# EAGLE design MySensors_Interfacing24V (EAGLE 8.3.2)
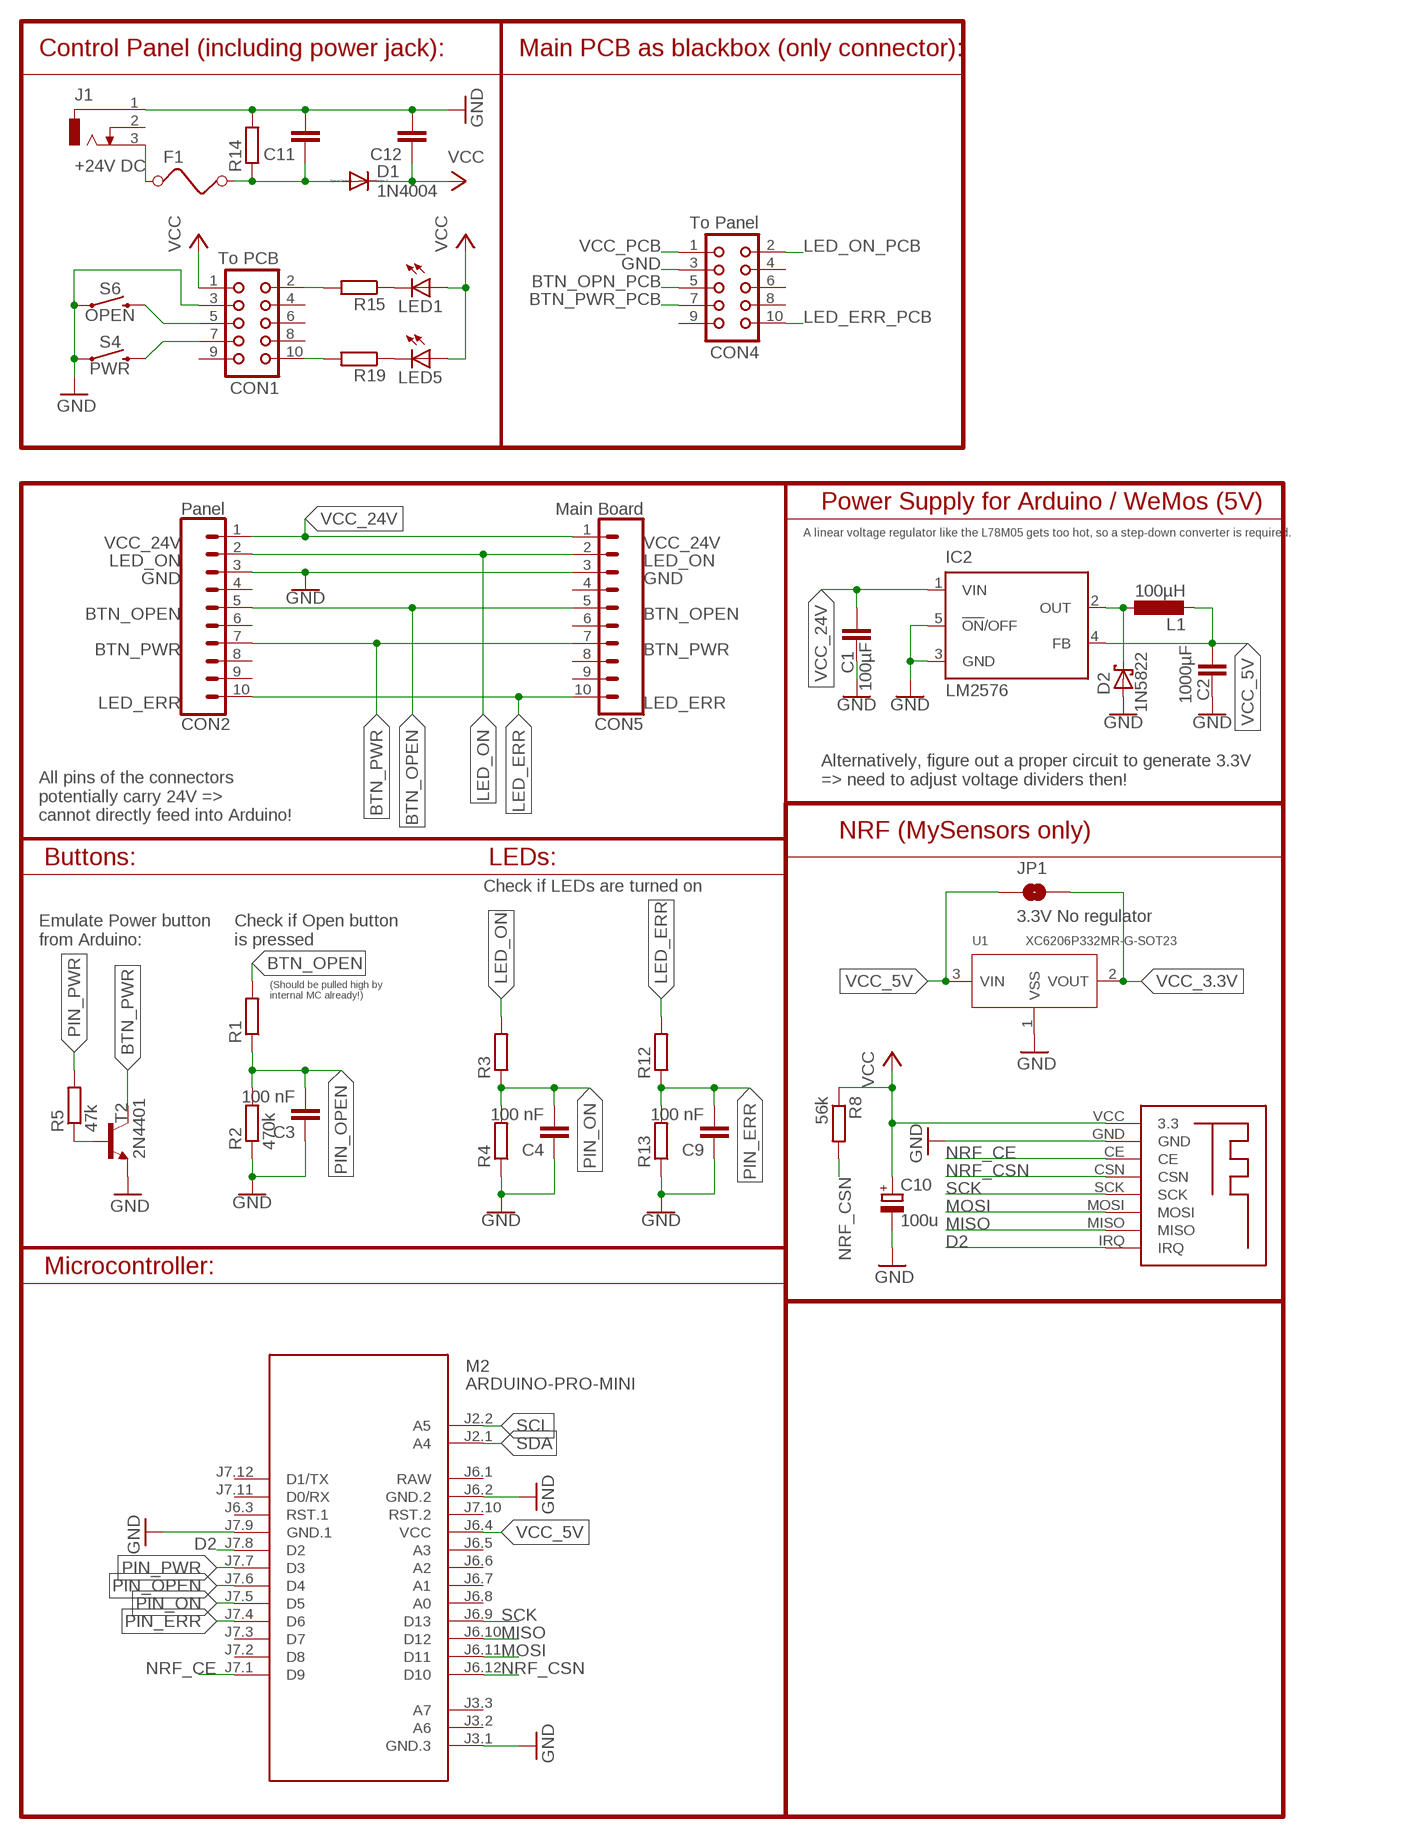
[diagram p0: schematic, sheet 1]

## Parts
C1  100µF  C-EUC0805  [C0805]
C2  1000µF  C-EUC0805  [C0805]
C3  100 nF  C-EUC0805  [C0805]
C4  100 nF  C-EUC0805  [C0805]
C9  100 nF  C-EUC0805  [C0805]
C10  100u  CPOL-EUUD-5X5,8  [UD-5X5,8_NICHICON]
C11  C-EUC0805K  [C0805K]
C12  C-EUC0805K  [C0805K]
CON1  To PCB  CON10  [CON10]
CON2  Panel  CONN_10LOCK_LONGPADS  [1X10_LOCK_LONGPADS]
CON4  To Panel  CON10  [CON10]
CON5  Main Board  CONN_10LOCK_LONGPADS  [1X10_LOCK_LONGPADS]
D1  1N4004  [DO41-10]
D2  1N5822  SCHOTTKY-DIODESMD  [SMB]
F1  FUSE  [FUSE]
IC2  LM2576  LM2596S  [TO263-5]
J1  +24V DC  DCJ0202  [DCJ0202]
JP1  3.3V No regulator  JUMPER-SMT_2_NO_SILK  [SMT-JUMPER_2_NO_SILK]
L1  100µH  L-EUWE-TPC  [POWER-CHOKE_WE-TPC]
LED1  LEDCHIPLED_0805  [CHIPLED_0805]
LED5  LEDCHIPLED_0805  [CHIPLED_0805]
M2  ARDUINO-PRO-MINI  ARDUINO-PRO-MINI-3.3V#NP  [ARDUINO-PRO-MINI#NP]
R1  R-EU_R0805  [R0805]
R2  470k  R-EU_R0805  [R0805]
R3  R-EU_R0805  [R0805]
R4  R-EU_R0805  [R0805]
R5  47k  R-EU_R0805  [R0805]
R8  56k  R-EU_R0805  [R0805]
R12  R-EU_R0805  [R0805]
R13  R-EU_R0805  [R0805]
R14  R-EU_R0805  [R0805]
R15  R-EU_R0805  [R0805]
R19  R-EU_R0805  [R0805]
S4  PWR  MOMENTARY-SWITCH-SPST-PTH-6.0MM  [TACTILE_SWITCH_PTH_6.0MM]
S6  OPEN  MOMENTARY-SWITCH-SPST-PTH-6.0MM  [TACTILE_SWITCH_PTH_6.0MM]
T2  2N4401  MMBT4401LT1-NPN-SOT23-BEC  [SOT23-BEC]
U1  XC6206P332MR-G-SOT23  PMIC-LDO-XC6206P332MR-G(SOT23)  [SOT-23]
U$2  NRF24SMD  [NRF24SMD]

## Nets
BTN_OPEN: CON2.5 CON5.5 R1.2
BTN_OPEN_PANEL: CON1.5 S6.3
BTN_OPN_PCB: CON4.5
BTN_PWR: CON2.7 CON5.7 T2.C
BTN_PWR_PANEL: CON1.7 S4.3
BTN_PWR_PCB: CON4.7
D2: M2.J7.8(D2) U$2.IRQ
GND: C1.2 C2.2 C3.1 C4.1 C9.1 C11.2 C12.2 CON1.3 CON2.3 CON4.3 CON5.3 D2.A IC2.3(GND) IC2.5(!ON!/OFF) J1.1 M2.J3.1(GND.3) M2.J6.2(GND.2) M2.J7.9(GND.1) R2.1 R4.1 R13.1 R14.2 S4.1 S6.1 T2.E
GND_ARD: C10.- U$2.GND ; supply symbol labelled GND
LED_ERR: CON2.10 CON5.10 R12.2
LED_ERR_PANEL: CON1.10 R19.2
LED_ERR_PCB: CON4.10
LED_ON: CON2.2 CON5.2 R3.2
LED_ON_PANEL: CON1.2 R15.2
LED_ON_PCB: CON4.2
MISO: M2.J6.10(D12) U$2.MISO
MOSI: M2.J6.11(D11) U$2.MOSI
N$1: F1.1 J1.3
N$2: R5.1 T2.B
N$3: C11.1 D1.A F1.2 R14.1
N$4: D2.C IC2.2(OUT) L1.1
N$8: LED1.C R15.1
N$12: LED5.C R19.1
NRF_CE: M2.J7.1(D9) U$2.CE
NRF_CSN: M2.J6.12(D10) R8.2 U$2.CSN
PIN_ERR: C9.2 M2.J7.4(D6) R12.1 R13.2
PIN_ON: C4.2 M2.J7.5(D5) R3.1 R4.2
PIN_OPEN: C3.2 M2.J7.6(D4) R1.1 R2.2
PIN_PWR: M2.J7.7(D3)
SCK: M2.J6.9(D13) U$2.SCK
SCL: M2.J2.2(A5)
SDA: M2.J2.1(A4)
VCC: C12.1 D1.C LED1.A LED5.A
VCC_3.3V: C10.+ JP1.2 R8.1 U1.2(VOUT) U$2.VCC(3.3) ; supply symbol labelled VCC
VCC_5V: C2.1 IC2.4(FB) JP1.1 L1.2 M2.J6.4(VCC) U1.3(VIN)
VCC_24V: C1.1 CON1.1 CON2.1 CON5.1 IC2.1(VIN) ; supply symbol labelled VCC
VCC_PCB: CON4.1
VSS: U1.1(VSS) ; supply symbol labelled GND
Unconnected: CON1.4 CON1.6 CON1.8 CON1.9 CON2.4 CON2.6 CON2.8 CON2.9 CON4.4 CON4.6 CON4.8 CON4.9 CON5.4 CON5.6 CON5.8 CON5.9 J1.2 M2.J3.2(A6) M2.J3.3(A7) M2.J6.3(RST.1) M2.J6.5(A3) M2.J6.6(A2) M2.J6.7(A1) M2.J6.8(A0) M2.J7.2(D8) M2.J7.3(D7) M2.J7.10(RST.2) M2.J7.11(D0/RX) M2.J7.12(D1/TX) R5.2

## Notes on the sheet
- Control Panel (including power jack): | Main PCB as blackbox (only connector):
- Power Supply for Arduino / WeMos (5V)
- A linear voltage regulator like the L78M05 gets too hot, so a step-down converter is required.
- Alternatively, figure out a proper circuit to generate 3.3V 
  => need to adjust voltage dividers then!
- All pins of the connectors 
  potentially carry 24V => 
  cannot directly feed into Arduino!
- NRF (MySensors only)
- Buttons: | LEDs:
- Check if LEDs are turned on
- Emulate Power button 
  from Arduino:
- Check if Open button 
  is pressed
- (Should be pulled high by 
  internal MC already!)
- Microcontroller:

## Power pins joined to a net without a drawn wire
RAW: M2.J6.1(RAW)

## Library data of the parts
C1 C2 C11 C12 = rcl:C-EU: CAPACITOR, European symbol
C3 C4 C9 = resistor:C-EU: CAPACITOR, European symbol
C10 = rcl:CPOL-EU: POLARIZED CAPACITOR, European symbol
CON1 CON4 = con-harting:CON10: CONNECTOR; OC_FARNELL: unknown; OC_NEWARK: unknown
CON2 CON5 = SparkFun-Connectors:CONN_10: Multi connection point. Often used as Generic Header-pin footprint for 0.1 inch spaced/style header connections On any of the 0.1 inch spaced packages, you can populate with these: Break Away Headers - Straight <https://www.sparkfun.com/products/116> (PRT-00116) Break Away Male Headers - Right Angle <https://www.sparkfun.com/products/553> (PRT-00553) Female Headers <https://www.sparkfun.com/products/115> (PRT-00115) Break Away Headers - Machine Pin <https://www.sparkfun.com/products/117> (PRT-00117) Break Away Female Headers - Swiss Machine Pin <https://www.sparkfun.com/products/743> (PRT-00743) Arduino Stackable Header - 10 Pin <https://www.sparkfun.com/products/11376> (PRT-11376) For SCREWTERMINALS and SPRING TERMINALS visit here: Screw Terimnals on SparkFun.com <https://www.sparkfun.com/search/results?term=Screw+Terminals> (5mm/3.5mm/2.54mm spacing) This device is also useful as a general connection point to wire up your design to another part of your project. Our various solder wires solder well into these plated through hole pads. Hook-Up Wire - Assortment (Stranded, 22 AWG) <https://www.sparkfun.com/products/11375> (PRT-11375) Hook-Up Wire - Assortment (Solid Core, 22 AWG) <https://www.sparkfun.com/products/11367> (PRT-11367) View the entire wire category on our website here <https://www.sparkfun.com/categories/141> Special notes: Molex polarized connector foot print use with SKU : PRT-08231 with associated crimp pins and housings. 1MM SMD Version SKU: PRT-10208 NOTES ON THE VARIANTS LOCK and LOCK_LONGPADS... This footprint was designed to help hold the alignment of a through-hole component (i.e. 6-pin header) while soldering it into place. You may notice that each hole has been shifted either up or down by 0.005 of an inch from it's more standard position (which is a perfectly straight line). This slight alteration caused the pins (the squares in the middle) to touch the edges of the holes. Because they are alternating, it causes a "brace" to hold the component in place. 0.005 has proven to be the perfect amount of "off-center" position when using our standard breakaway headers. Although looks a little odd when you look at the bare footprint, once you have a header in there, the alteration is very hard to notice. Also,if you push a header all the way into place, it is covered up entirely on the bottom side.
D1 = diode:1N4004: DIODE general purpose rectifier, 1 A
D2 = diode:SCHOTTKY-DIODE: Schottky Diode
F1 = special:FUSE: FUSE 5 x 20 mm
IC2 = national-semiconductor:LM2596: SIMPLE SWITCHER® Power Converter 150 kHz 3A Step-Down Voltage Regulator Source: http://www.national.com/ds/LM/LM2596.pdf; MF: NATIONAL SEMICONDUCTOR; MPN: LM2596S-ADJ/NOPB; OC_FARNELL: 9494367; OC_NEWARK: 41K3842
J1 = con-jack:DCJ0202: DC POWER JACK Source: DCJ0202.pdf; OC_FARNELL: unknown; OC_NEWARK: unknown
JP1 = SparkFun-Jumpers:JUMPER-SMT_2_NO: Normally open jumper This jumper has two pads in close proximity to each other. Apply solder to close the connection. Round pads are easier to solder for beginners, but are a lot larger. SparkFun Product that uses the round pads: SparkFun EL Sequencer <https://www.sparkfun.com/products/12781>
L1 = rcl:L-EU: INDUCTOR, European symbol
LED1 LED5 = led:LED: LED OSRAM: - CHIPLED LG R971, LG N971, LY N971, LG Q971, LY Q971, LO R971, LY R971 LH N974, LH R974 LS Q976, LO Q976, LY Q976 LO Q996 - Hyper CHIPLED LW Q18S LB Q993, LB Q99A, LB R99A - SideLED LS A670, LO A670, LY A670, LG A670, LP A670 LB A673, LV A673, LT A673, LW A673 LH A674 LY A675 LS A676, LA A676, LO A676, LY A676, LW A676 LS A679, LY A679, LG A679 - Hyper Micro SIDELED® LS Y876, LA Y876, LO Y876, LY Y876 LT Y87S - SmartLED LW L88C, LW L88S LB L89C, LB L89S, LG L890 LS L89K, LO L89K, LY L89K LS L896, LA L896, LO L896, LY L896 - TOPLED LS T670, LO T670, LY T670, LG T670, LP T670 LSG T670, LSP T670, LSY T670, LOP T670, LYG T670 LG T671, LOG T671, LSG T671 LB T673, LV T673, LT T673, LW T673 LH T674 LS T676, LA T676, LO T676, LY T676, LB T676, LH T676, LSB T676, LW T676 LB T67C, LV T67C, LT T67C, LS T67K, LO T67K, LY T67K, LW E67C LS E67B, LA E67B, LO E67B, LY E67B, LB E67C, LV E67C, LT E67C LW T67C LS T679, LY T679, LG T679 LS T770, LO T770, LY T770, LG T770, LP T770 LB T773, LV T773, LT T773, LW T773 LH T774 LS E675, LA E675, LY E675, LS T675 LS T776, LA T776, LO T776, LY T776, LB T776 LHGB T686 LT T68C, LB T68C - Hyper Mini TOPLED® LB M676 - Mini TOPLED Santana® LG M470 LS M47K, LO M47K, LY M47K Source: http://www.osram.convergy.de LUXEON: - LUMILED® LXK2-PW12-R00, LXK2-PW12-S00, LXK2-PW14-U00, LXK2-PW14-V00 LXK2-PM12-R00, LXK2-PM12-S00, LXK2-PM14-U00 LXK2-PE12-Q00, LXK2-PE12-R00, LXK2-PE12-S00, LXK2-PE14-T00, LXK2-PE14-U00 LXK2-PB12-K00, LXK2-PB12-L00, LXK2-PB12-M00, LXK2-PB14-N00, LXK2-PB14-P00, LXK2-PB14-Q00 LXK2-PR12-L00, LXK2-PR12-M00, LXK2-PR14-Q00, LXK2-PR14-R00 LXK2-PD12-Q00, LXK2-PD12-R00, LXK2-PD12-S00 LXK2-PH12-R00, LXK2-PH12-S00 LXK2-PL12-P00, LXK2-PL12-Q00, LXK2-PL12-R00 Source: www.luxeon.com KINGBRIGHT: KA-3528ASYC Source: www.kingbright.com
M2 = diy-modules:ARDUINO-PRO-MINI-*#NP: Arduino Pro Mini (and compatible devices) without programming pads More details available here: https://www.arduino.cc/en/Main/ArduinoBoardProMini Click here to find device on ebay.com <http://www.ebay.com/sch/arduino+pro+mini>
R1-R5 R12-R15 R19 = resistor:R-EU_: RESISTOR, European symbol
R8 = rcl:R-EU_: RESISTOR, European symbol
S4 S6 = SparkFun-Switches:MOMENTARY-SWITCH-SPST: Momentary Switch (Pushbutton) - SPST Normally-open (NO) SPST momentary switches (buttons, pushbuttons). Variants PTH-12MM - 12mm square, through-hole Momentary Pushbutton Switch - 12mm Square <https://www.sparkfun.com/products/9190> (COM-09190) PTH-6.0MM, PTH-6.0MM-KIT - 6.0mm square, through-hole Mini Pushbutton Switch <https://www.sparkfun.com/products/97> (COM-00097) KIT package intended for soldering kit's - only one side of pads' copper is exposed. PTH-RIGHT-ANGLE-KIT - Right-angle, through-hole Right Angle Tactile Button <https://www.sparkfun.com/products/10791> - Used on SparkFun BigTime Watch Kit <https://www.sparkfun.com/products/11734> SMD-12MM - 12mm square, surface-mount Tactile Button - SMD (12mm) <https://www.sparkfun.com/products/12993> (COM-12993) Used on SparkFun PicoBoard <https://www.sparkfun.com/products/11888> SMD-4.5MM - 4.5mm Square Trackball Switch Used on SparkFun Blackberry Trackballer Breakout <https://www.sparkfun.com/products/13169> SMD-4.6MMX2.8MM - 4.60mm x 2.80mm, surface mount Used on SparkFun SAMD21 Mini Breakout <https://www.sparkfun.com/products/13664> SMD-5.2MM, SMD-5.2-REDUNDANT - 5.2mm square, surface-mount Mini Pushbutton Switch - SMD <https://www.sparkfun.com/products/8720> (COM-08720) Used on Arduino Pro Mini <https://www.sparkfun.com/products/11114> REDUNDANT package connects both switch circuits together SMD-6.0X3.5MM - 6.0 x 3.5mm, surface mount Momentary Reset Switch SMD <https://www.sparkfun.com/products/8229> (COM-08229) SMD-6.2MM-TALL - 6.2mm square, surface mount Tactile Button - SMD (6mm) <https://www.sparkfun.com/products/12992> Used on SparkFun Digital Sandbox <https://www.sparkfun.com/products/12651> SMD-RIGHT-ANGLE - Right-angle, surface mount Used on SparkFun Block for Intel® Edison - Arduino <https://www.sparkfun.com/products/13036>; PROD_ID: SWCH-08441; SF_SKU: COM-00097
T2 = transistor:*-NPN-: NPN Transistror BF959 corrected 2008.03.06
U1 = Seeed-IC:PMIC-LDO-XC6206P332MR-G(SOT23): 310030099; MPN: XC6206P332MR-G
U$2 = NRF24_SMD:NRF24SMD

## Board
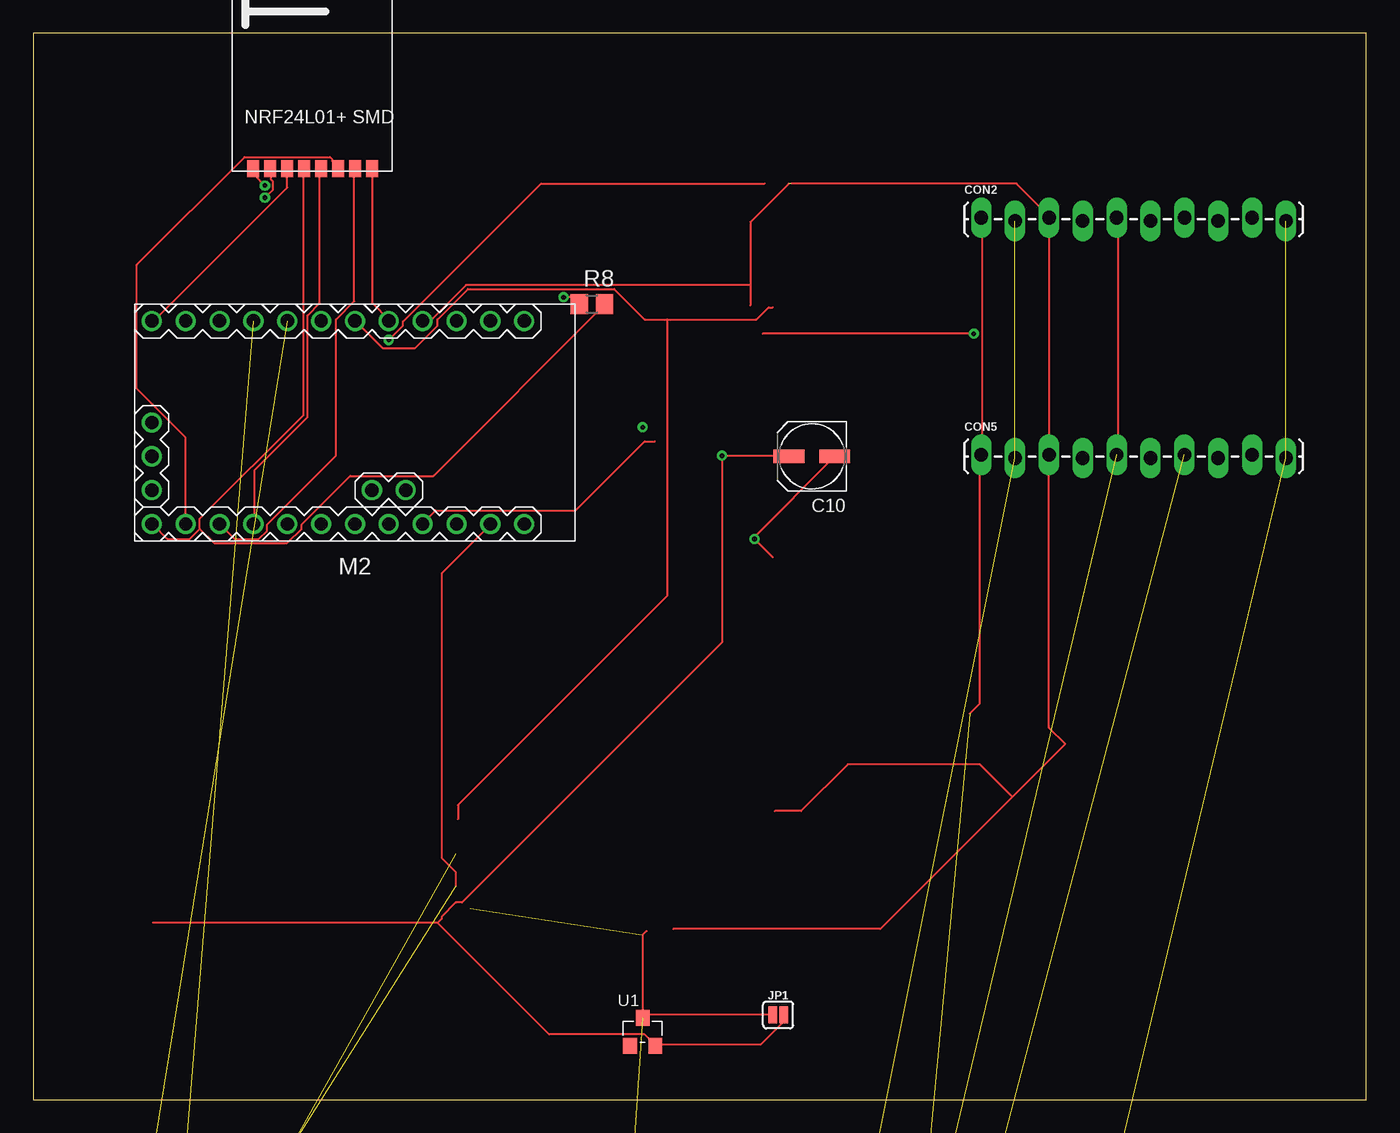
[diagram p1: board, top side]
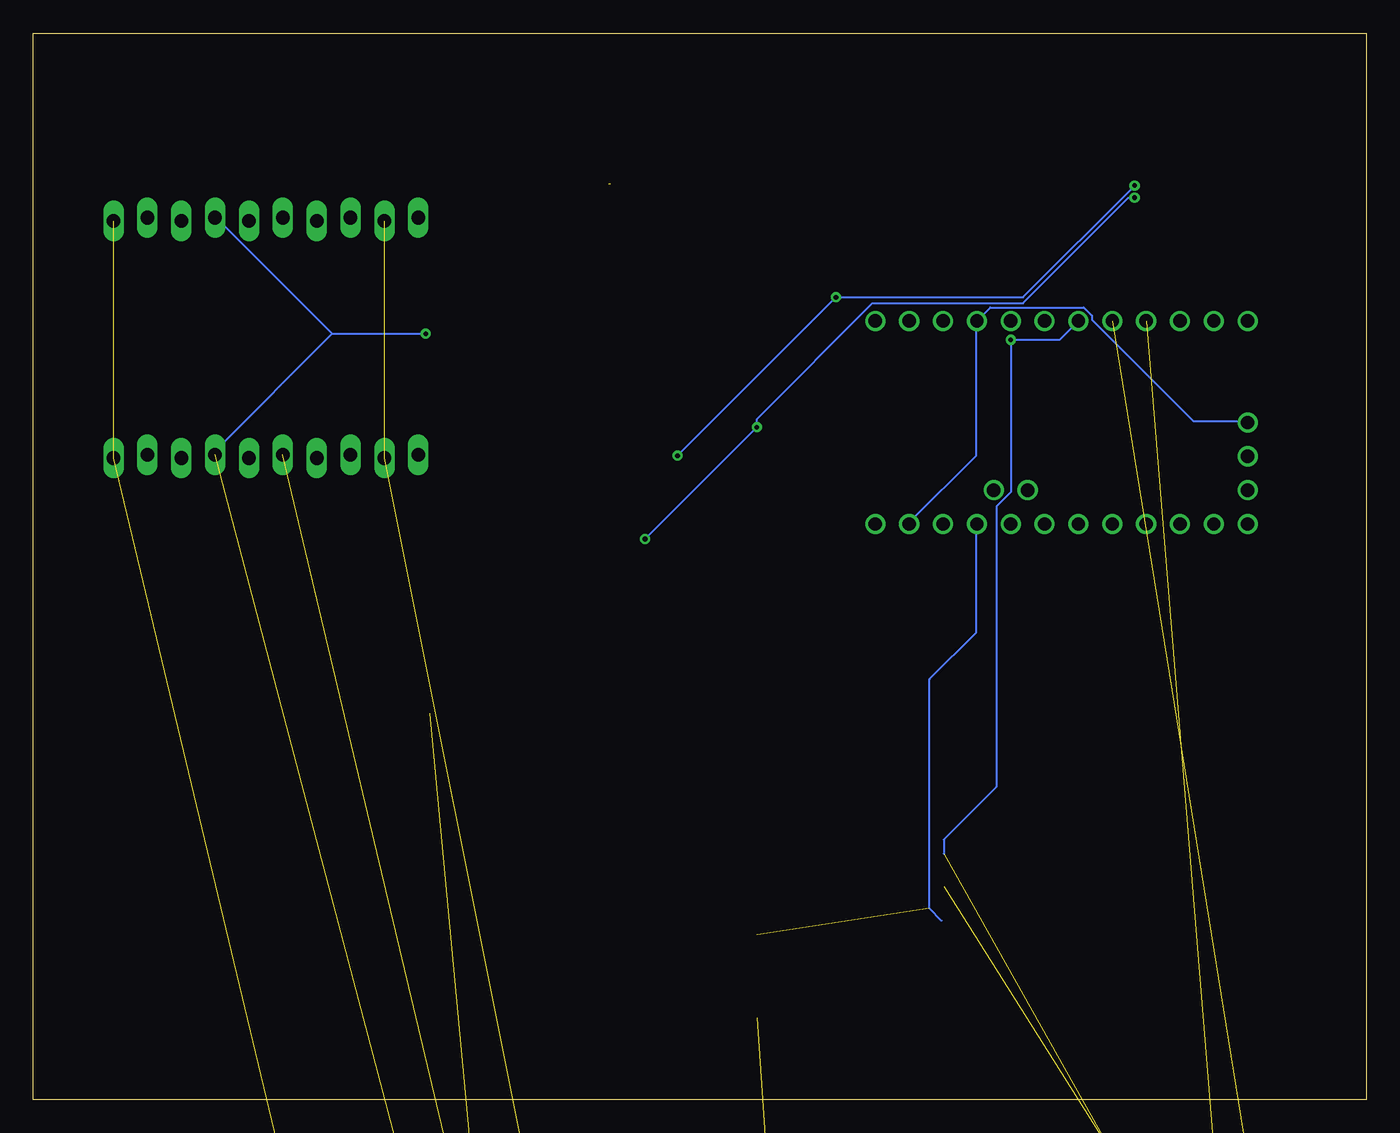
[diagram p2: board, bottom side, seen from below]

Size 100 x 80 mm. Coordinates in mm from the lower left corner, seen from the top.
Outline: 0,0 100,0 100,80 0,80 0,0
Copper layers (1*16): Top 0.035mm / dielectric 1.5mm / Bottom 0.035mm
Design rules "default": minimum track width 6mil, minimum drill 0.35mm, track to track 6mil, track to pad 6mil, pad to pad 6mil, via to via 6mil, smd to smd 6mil, copper to edge 40mil, drill to drill 6mil, minimum pad ring 10mil, minimum via ring 8mil, stop-mask expansion 4mil, vias tented up to drill 0mil, thermal gap 10mil

### Footprints (pad centres in the part's own frame; a part is rotated, then mirrored left to right if it is on the bottom)
C0805 = smd 1.3 x 1.5: 1 -0.95,0; 2 0.95,0
UD-5X5,8_NICHICON = smd 2.3 x 1: + 1.725,0; - -1.7,0
C0805K = smd 1.3 x 1.6: 1 -1,0; 2 1,0
CON10 = drill 0.914: 1 -5.08,-1.27 | drill 0.914 octagon: 2 -5.08,1.27; 3 -2.54,-1.27; 4 -2.54,1.27; 5 0,-1.27; 6 0,1.27; 7 2.54,-1.27; 8 2.54,1.27; 9 5.08,-1.27; 10 5.08,1.27
1X10_LOCK_LONGPADS = drill 1.016 long: 1 0,0.127; 2 2.54,-0.127; 3 5.08,0.127; 4 7.62,-0.127; 5 10.16,0.127; 6 12.7,-0.127; 7 15.24,0.127; 8 17.78,-0.127; 9 20.32,0.127; 10 22.86,-0.127
DO41-10 = drill 1.118: A 5.08,0; C -5.08,0
SMB = smd 2.4 x 2.4: A 2.2,0; C -2.2,0
FUSE = drill 1.321 long: 1 -11.43,0; 2 11.43,0
TO263-5 = smd 1.067 x 2.159: 1 -3.404,-5.791; 2 -1.702,-5.791; 3 0,-5.791; 4 1.702,-5.791; 5 3.404,-5.791 | smd 10.8 x 10.41: 6 0,2.54
DCJ0202 = drill 1 pad 2 long: 1 0,3.1; 2 4.8,0; 3 0,-3
SMT-JUMPER_2_NO_SILK = smd 0.635 x 1.27: 1 -0.406,0; 2 0.406,0
POWER-CHOKE_WE-TPC = smd 6.3 x 2.2: 1 0,2.05; 2 0,-2.05
CHIPLED_0805 = smd 1.2 x 1.2: A 0,-1.05; C 0,1.05
ARDUINO-PRO-MINI#NP = drill 1: J2.1 -1.27,5.08; J2.2 -3.81,5.08; J3.1 15.24,0; J3.2 15.24,2.54; J3.3 15.24,5.08; J6.1 -12.7,7.62; J6.2 -10.16,7.62; J6.3 -7.62,7.62; J6.4 -5.08,7.62; J6.5 -2.54,7.62; J6.6 0,7.62; J6.7 2.54,7.62; J6.8 5.08,7.62; J6.9 7.62,7.62; J6.10 10.16,7.62; J6.11 12.7,7.62; J6.12 15.24,7.62; J7.1 15.24,-7.62; J7.2 12.7,-7.62; J7.3 10.16,-7.62; J7.4 7.62,-7.62; J7.5 5.08,-7.62; J7.6 2.54,-7.62; J7.7 0,-7.62; J7.8 -2.54,-7.62; J7.9 -5.08,-7.62; J7.10 -7.62,-7.62; J7.11 -10.16,-7.62; J7.12 -12.7,-7.62
R0805 = smd 1.3 x 1.5: 1 -0.95,0; 2 0.95,0
TACTILE_SWITCH_PTH_6.0MM = drill 1.016 pad 1.88: 1 -3.251,2.261; 2 3.251,2.261; 3 -3.251,-2.261; 4 3.251,-2.261
SOT23-BEC = smd 1 x 1.4: B -0.95,-1.1; C 0,1.1; E 0.95,-1.1
SOT-23 = smd 1.016 x 1.2: 1 -0.95,-1.06; 2 0.95,-1.06; 3 0,1.06
NRF24SMD = smd 0.9 x 1.27: CE -1.27,-6.35; CSN 0,-6.35; GND -2.54,-6.35; IRQ 5.08,-6.35; MISO 3.81,-6.35; MOSI 2.54,-6.35; SCK 1.27,-6.35; VCC -3.81,-6.35

### Placement (x,y rotation side)
C1  20.32,-440.69 0 top  (outside the outline)
C2  12.7,-440.69 0 top  (outside the outline)
C3  2.54,-31.75 0 top  (outside the outline)
C4  2.54,-38.1 0 top  (outside the outline)
C9  2.54,-101.6 0 top  (outside the outline)
C10  58.42,48.26 180 top
C11  -1,-415.29 0 top  (outside the outline)
C12  -1,-427.99 0 top  (outside the outline)
CON1  55.88,-177.8 0 top  (outside the outline)
CON2  71.12,66.04 0 top
CON4  12.7,-198.12 0 top  (outside the outline)
CON5  71.12,48.26 0 top
D1  39.37,-196.85 0 top  (outside the outline)
D2  3.81,-440.69 0 top  (outside the outline)
F1  21.59,-177.8 0 top  (outside the outline)
IC2  15.24,-414.02 0 top  (outside the outline)
J1  10.16,-130.81 0 top  (outside the outline)
JP1  55.88,6.35 0 top
L1  7.62,-430.53 0 top  (outside the outline)
LED1  21.59,-210.82 0 top  (outside the outline)
LED5  46.99,-210.82 0 top  (outside the outline)
M2  24.13,50.8 180 top
R1  -0.95,-294.47 0 top  (outside the outline)
R2  -0.95,-307.17 0 top  (outside the outline)
R3  -0.95,-319.87 0 top  (outside the outline)
R4  -0.95,-332.57 0 top  (outside the outline)
R5  0,-402.59 0 top  (outside the outline)
R8  41.91,59.69 0 top
R12  -0.95,-345.27 0 top  (outside the outline)
R13  -0.95,-357.97 0 top  (outside the outline)
R14  -0.95,-370.67 0 top  (outside the outline)
R15  -0.95,-383.37 0 top  (outside the outline)
R19  -0.95,-396.07 0 top  (outside the outline)
S4  38.1,-129.54 0 top  (outside the outline)
S6  38.1,-156.21 0 top  (outside the outline)
T2  0,-280.67 0 top  (outside the outline)
U1  45.72,5.08 0 top
U$2  20.32,76.2 0 top

### Tracks (layer width: path | path; a pad name or v marks a point on that pad's centre or on a via)
BTN_OPEN  (1 unrouted)
  Top 0.152: CON5.5 81.38,48.46 81.38,66.14 CON2.5
BTN_OPEN_PANEL  (1 unrouted)
BTN_PWR  (via drill 0.35)  (1 unrouted)
  Top 0.152: v70.56,57.45 54.71,57.45
  Bottom 0.152: 77.57,57.45 v70.56,57.45 | 77.57,57.45 86.26,66.14 CON2.7 | 77.57,57.45 86.26,48.77 86.26,48.46 CON5.7
BTN_PWR_PANEL  (1 unrouted)
D2
  Top 0.152: U$2.IRQ 25.45,69.8 25.45,59.74 26.67,58.52 M2.J7.8
GND  (21 unrouted)
  Top 0.152: 31.7,16 31.7,17.07 30.63,18.14 30.63,39.47 34.29,43.13 M2.J6.2 | 53.8,61.11 53.8,65.84 56.69,68.73 | 53.8,61.11 53.8,59.59 | 56.84,68.73 73.76,68.73 76.2,66.29 CON2.3 CON5.3 76.2,27.89 77.42,26.67 73.46,22.71 | 48.01,12.8 63.55,12.8 73.46,22.71 | 55.63,21.64 57.61,21.64 61.11,25.15 71.02,25.15 73.46,22.71 | 53.8,61.11 32.46,61.11 29.87,58.52 29.26,58.52 M2.J7.9
  Bottom 0.152: M2.J3.1 8.99,50.9 12.95,50.9 20.57,58.52 20.57,58.83 21.18,59.44 28.19,59.44 M2.J7.9 29.26,58.37 29.26,48.31 34.29,43.28 M2.J6.2
GND_ARD  (via drill 0.35)
  Top 0.152: 55.47,40.69 v54.1,42.06 54.1,42.22 60.05,48.16 C10.- | v17.37,67.67 17.98,68.28 17.98,68.89 17.83,69.04 17.83,69.8 U$2.GND
  Bottom 0.152: v54.1,42.06 v45.72,50.44 45.72,51.05 37.03,59.74 25.76,59.74 17.83,67.67 v17.37,67.67
LED_ERR  (2 unrouted)
LED_ERR_PANEL  (1 unrouted)
LED_ON  (2 unrouted)
LED_ON_PANEL  (1 unrouted)
MISO
  Top 0.152: M2.J6.10 15.09,42.06 16.92,42.06 17.53,42.67 17.53,43.13 22.71,48.31 22.71,58.52 24.08,59.89 24.08,69.8 U$2.MISO
MOSI
  Top 0.152: M2.J6.11 11.43,49.68 7.77,53.34 7.77,62.64 15.85,70.71 22.25,70.71 22.4,70.56 22.4,70.41 22.86,69.95 U$2.MOSI
N$1  (1 unrouted)
N$2  (1 unrouted)
N$3  (3 unrouted)
N$4  (2 unrouted)
N$8  (1 unrouted)
N$12  (1 unrouted)
NRF_CE
  Top 0.152: U$2.CE 19.05,68.43 8.99,58.37 M2.J7.1
NRF_CSN
  Top 0.152: 12.5,42.82 12.5,43.59 20.27,51.36 20.27,69.8 U$2.CSN | 12.5,42.82 11.73,42.06 10.06,42.06 8.99,43.13 M2.J6.12 | 12.5,42.82 13.56,41.76 19.05,41.76 20.12,42.82 20.12,43.13 23.77,46.79 30.02,46.79 42.82,59.59 R8.2
PIN_ERR  (3 unrouted)
PIN_ON  (3 unrouted)
PIN_OPEN  (via drill 0.35)  (3 unrouted)
  Top 0.152: 54.86,68.73 38.1,68.73 27.74,58.37 27.74,58.06 v26.67,57
  Bottom 0.152: M2.J7.6 23.01,57 v26.67,57 26.67,45.57 27.74,44.5 27.74,23.47 31.7,19.51 31.7,18.44
PIN_PWR
  Top 0.152: 55.47,59.44 55.17,59.44 54.25,58.52 47.55,58.52 | 47.55,58.52 45.87,58.52 43.59,60.81 32.61,60.81 30.33,58.52 30.33,58.06 28.65,56.39 26.21,56.39 24.23,58.37 M2.J7.7 | 31.85,21.03 31.85,22.1 47.55,37.8 47.55,58.52
SCK
  Top 0.152: U$2.SCK 21.49,69.8 21.49,59.74 20.57,58.83 20.57,51.21 16.61,47.24 16.61,43.28 M2.J6.9
VCC  (3 unrouted)
VCC_3.3V  (via drill 0.35)
  Top 0.152: JP1.2 56.24,6.25 56.24,5.79 54.56,4.12 46.79,4.12 U1.2 46.63,4.12 45.87,4.88 38.71,4.88 30.33,13.26 | 30.33,13.26 8.99,13.26 | v17.37,68.58 16.61,69.34 16.61,69.8 U$2.VCC | v39.78,60.2 40.39,60.2 40.84,59.74 R8.1 | C10.+ 56.69,48.31 v51.66,48.31 51.66,34.29 32.16,14.78 31.7,14.78 30.63,13.72 30.63,13.56 30.33,13.26
  Bottom 0.152: v17.37,68.58 25.76,60.2 v39.78,60.2 v51.66,48.31
VCC_5V  (4 unrouted)
  Top 0.152: 46.63,49.38 45.87,49.38 40.69,44.2 30.18,44.2 29.26,43.28 M2.J6.4 | 45.72,6.4 45.72,12.34 46.02,12.65 | 45.72,6.4 U1.3 45.72,6.25 | 45.72,6.4 55.47,6.4 JP1.1
  Bottom 0.152: 31.85,13.41 32.77,14.33 32.77,31.55 29.26,35.05 29.26,43.13 M2.J6.4
VCC_24V  (3 unrouted)
  Top 0.152: CON2.1 71.17,66.14 71.17,48.46 CON5.1 71.02,48.31 71.02,29.72 70.26,28.96